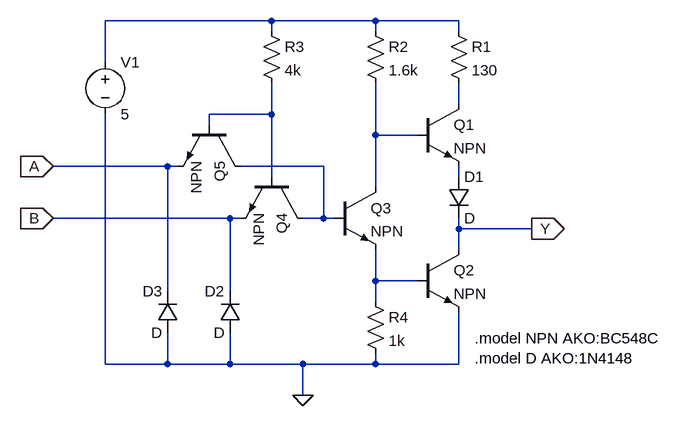
[diagram p0: schematic NAND.asc]
NAND.asc, the LTspice schematic file:
Version 4
SHEET 1 880 680
WIRE -32 -64 -288 -64
WIRE 128 -64 -32 -64
WIRE 256 -64 128 -64
WIRE -32 -48 -32 -64
WIRE 128 -48 128 -64
WIRE 256 -48 256 -64
WIRE -288 0 -288 -64
WIRE 256 64 256 32
WIRE -32 80 -32 32
WIRE -32 80 -128 80
WIRE -128 96 -128 80
WIRE 128 112 128 32
WIRE 192 112 128 112
WIRE -192 160 -368 160
WIRE -176 160 -192 160
WIRE 48 160 -80 160
WIRE -32 176 -32 80
WIRE 256 176 256 160
WIRE 128 192 128 112
WIRE -96 240 -368 240
WIRE -80 240 -96 240
WIRE 48 240 48 160
WIRE 48 240 16 240
WIRE 64 240 48 240
WIRE 256 256 256 240
WIRE 368 256 256 256
WIRE 256 288 256 256
WIRE 128 336 128 288
WIRE 192 336 128 336
WIRE -192 352 -192 160
WIRE -96 352 -96 240
WIRE 128 368 128 336
WIRE -288 464 -288 80
WIRE -192 464 -192 416
WIRE -192 464 -288 464
WIRE -96 464 -96 416
WIRE -96 464 -192 464
WIRE 16 464 -96 464
WIRE 128 464 128 448
WIRE 128 464 16 464
WIRE 256 464 256 384
WIRE 256 464 128 464
WIRE 16 512 16 464
FLAG 16 512 0
FLAG -368 240 B
IOPIN -368 240 In
FLAG 368 256 Y
IOPIN 368 256 Out
FLAG -368 160 A
IOPIN -368 160 In
SYMBOL npn 192 64 R0
SYMATTR InstName Q1
SYMBOL npn 192 288 R0
SYMATTR InstName Q2
SYMBOL npn 64 192 R0
SYMATTR InstName Q3
SYMBOL npn 16 176 R90
SYMATTR InstName Q4
SYMBOL res 240 -64 R0
SYMATTR InstName R1
SYMATTR Value 130
SYMBOL res 112 -64 R0
SYMATTR InstName R2
SYMATTR Value 1.6k
SYMBOL res -48 -64 R0
SYMATTR InstName R3
SYMATTR Value 4k
SYMBOL res 112 352 R0
SYMATTR InstName R4
SYMATTR Value 1k
SYMBOL diode 240 176 R0
SYMATTR InstName D1
SYMBOL diode -80 416 R180
WINDOW 0 24 64 Left 2
WINDOW 3 24 0 Left 2
SYMATTR InstName D2
SYMBOL voltage -288 -16 R0
WINDOW 123 0 0 Left 2
WINDOW 39 0 0 Left 2
SYMATTR InstName V1
SYMATTR Value 5
SYMBOL npn -80 96 R90
SYMATTR InstName Q5
SYMBOL diode -176 416 R180
WINDOW 0 24 64 Left 2
WINDOW 3 24 0 Left 2
SYMATTR InstName D3
TEXT 280 424 Left 2 !.model NPN AKO:BC548C\n.model D AKO:1N4148

The netlist it stands for:
* NAND.asc
Q1 N002 N004 N006 0 NPN
Q2 Y N007 0 0 NPN
Q3 N004 N005 N007 0 NPN
Q4 N005 N003 B 0 NPN
R1 N001 N002 130
R2 N001 N004 1.6k
R3 N001 N003 4k
R4 N007 0 1k
D1 N006 Y D
D2 0 B D
V1 N001 0 5
Q5 N005 N003 A 0 NPN
D3 0 A D
.model D D
.lib standard.dio
.model NPN NPN
.model PNP PNP
.lib standard.bjt
.model NPN AKO:BC548C
.model D AKO:1N4148
.backanno
.end